# EAGLE design working (EAGLE 9.6.2)
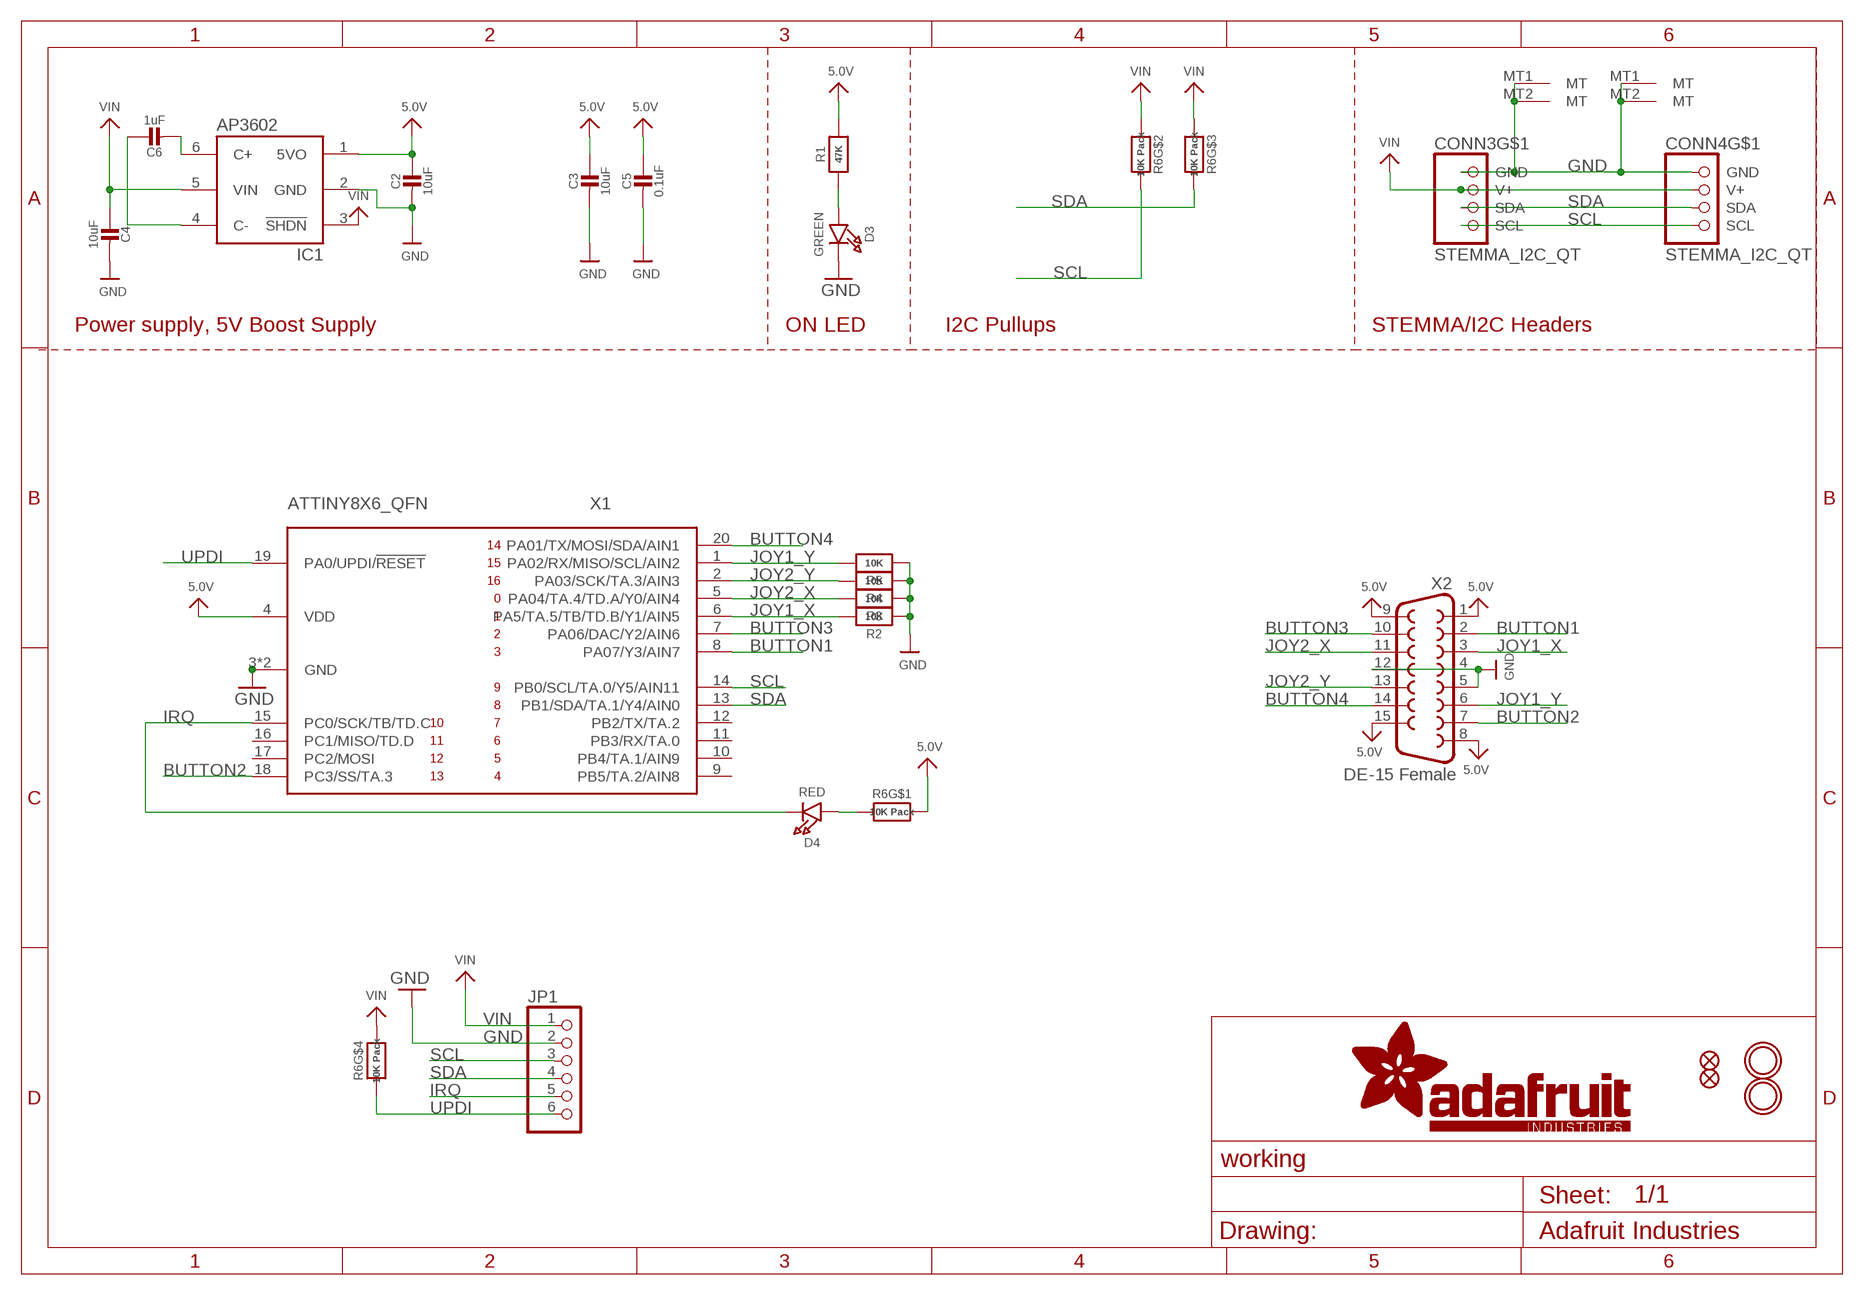
[diagram p0: schematic, sheet 1]

## Parts
C2  10uF  CAP_CERAMIC0805-NOOUTLINE  [0805-NO]
C3  10uF  CAP_CERAMIC0805-NOOUTLINE  [0805-NO]
C4  10uF  CAP_CERAMIC0805-NOOUTLINE  [0805-NO]
C5  0.1uF  CAP_CERAMIC0603_NO  [0603-NO]
C6  1uF  CAP_CERAMIC0603_NO  [0603-NO]
CONN3  STEMMA_I2C_QT  [JST_SH4]
CONN4  STEMMA_I2C_QT  [JST_SH4]
D3  GREEN  LED0603_NOOUTLINE  [CHIPLED_0603_NOOUTLINE]
D4  RED  LED0603_NOOUTLINE  [CHIPLED_0603_NOOUTLINE]
FID1  FIDUCIAL_1MM  [FIDUCIAL_1MM]
FID2  FIDUCIAL_1MM  [FIDUCIAL_1MM]
IC1  AP3602  [SOT23-6]
JP1  HEADER-1X670MIL  [1X06_ROUND_70]
R1  47K  RESISTOR_0603_NOOUT  [0603-NO]
R2  10K  RESISTOR_0603_NOOUT  [0603-NO]
R3  10K  RESISTOR_0603_NOOUT  [0603-NO]
R4  10K  RESISTOR_0603_NOOUT  [0603-NO]
R5  10K  RESISTOR_0603_NOOUT  [0603-NO]
R6  10K Pack  RESISTOR_4PACK  [RESPACK_4X0603]
U$6  MOUNTINGHOLE2.5  [MOUNTINGHOLE_2.5_PLATED]
U$18  MOUNTINGHOLE2.5  [MOUNTINGHOLE_2.5_PLATED]
X1  ATTINY8X6_QFN  [QFN20_3MM]
X2  DE-15 Female  F15H  [F15H]

## Nets
5.0V: C2.1 C3.1 C5.1 IC1.1(5VO) R1.2 R6.8 X1.4(VDD) X2.1 X2.8 X2.9 X2.15
BUTTON1: X1.8(PA07/Y3/AIN7) X2.2
BUTTON2: X1.18(PC3/SS/TA.3) X2.7
BUTTON3: X1.7(PA06/DAC/Y2/AIN6) X2.10
BUTTON4: X1.20(PA01/TX/MOSI/SDA/AIN1) X2.14
GND [highpower]: C2.2 C3.2 C4.2 C5.2 CONN3.1(GND) CONN3.MT1(MT) CONN3.MT2(MT) CONN4.1(GND) CONN4.MT1(MT) CONN4.MT2(MT) D3.C IC1.2(GND) JP1.2 R2.1 R3.1 R4.1 R5.1 X1.3(GND) X1.PAD(GND) X2.4 X2.5 X2.12
IRQ: D4.C JP1.5 X1.15(PC0/SCK/TB/TD.C)
JOY1_X: R2.2 X1.6(PA5/TA.5/TB/TD.B/Y1/AIN5) X2.3
JOY1_Y: R5.2 X1.1(PA02/RX/MISO/SCL/AIN2) X2.6
JOY2_X: R3.2 X1.5(PA04/TA.4/TD.A/Y0/AIN4) X2.11
JOY2_Y: R4.2 X1.2(PA03/SCK/TA.3/AIN3) X2.13
N$1: D3.A R1.1
N$2: C6.2 IC1.6(C+)
N$3: C6.1 IC1.4(C-)
N$4: D4.A R6.1
SCL: CONN3.4(SCL) CONN4.4(SCL) JP1.3 R6.7 X1.14(PB0/SCL/TA.0/Y5/AIN11)
SDA: CONN3.3(SDA) CONN4.3(SDA) JP1.4 R6.6 X1.13(PB1/SDA/TA.1/Y4/AIN0)
UPDI: JP1.6 R6.4 X1.19(PA0/UPDI/!RESET)
VIN [highpower]: C4.1 CONN3.2(V+) CONN4.2(V+) IC1.3(!SHDN) IC1.5(VIN) JP1.1 R6.2 R6.3 R6.5
Unconnected: X1.9(PB5/TA.2/AIN8) X1.10(PB4/TA.1/AIN9) X1.11(PB3/RX/TA.0) X1.12(PB2/TX/TA.2) X1.16(PC1/MISO/TD.D) X1.17(PC2/MOSI)

## Notes on the sheet
- Power supply, 5V Boost Supply | ON LED | I2C Pullups | STEMMA/I2C Headers

## Library data of the parts
C2-C6 = microbuilder:CAP_CERAMIC: Ceramic Capacitors For new designs, use the packages preceded by an '_' character since they are more reliable: The following footprints should be used on most boards: _0402 - Standard footprint for regular board layouts _0603 - Standard footprint for regular board layouts _0805 - Standard footprint for regular board layouts _1206 - Standard footprint for regular board layouts For extremely tight-pitch boards where space is at a premium, the following 'micro-pitch' footprints can be used (smaller pads, no silkscreen outline, etc.): _0402MP - Micro-pitch footprint for very dense/compact boards _0603MP - Micro-pitch footprint for very dense/compact boards _0805MP - Micro-pitch footprint for very dense/compact boards _1206MP - Micro-pitch footprint for very dense/compact boards
CONN3 CONN4 = adafruit_electromech:STEMMA_I2C; LCSC: C2845363
D3 D4 = microbuilder:LED: LED 0603 - 0603 Surface Mount Package 2mA: Green LED - Low Power (3.9mcd, 2ma, 1.7Vf) - Digikey: 475-2709-2-ND Orange LED - Low Power (9.8mcd, 2ma, 1.8Vf) - Digikey: 475-1194-2-ND Red LED - Low Power (5mcd, 2ma, 1.8Vf) - Digikey: 475-1195-2-ND Yellow LED - Low Power (7mcd, 2ma, 1.8Vf) - Digikey: 475-1196-2-ND 5mA: Blue LED - Low Power (17mcd, 5ma, 2.9Vf) - Digikey: LNJ937W8CRACT-ND 0805 - 0805 Surface Mount Package 2mA: Red LED (8.8mcd, 2mA, 1.8Vf, Clear) - Low Power [Digikey: 475-2510-1-ND] Green LED (5mcd, 2mA, 1.8Vf, Clear) - Low Power [Digikey: 475-2730-1-ND] Yellow LED (11.3mcd, 2mA, 1.8Vf, Clear) - Low Power [Digikey: 475-2555-1-ND] 20mA: Red LED (104mcd, 20mA, Diffused) - LS R976 [Digikey: 475-1278-6-ND] Red LED (12mcd, 20mA, 2.0Vf, Clear) - APT2012EC [Digikey: 754-1128-1-ND] Green LED (15mcd, 20mA, 2.2Vf, Clear) - APT2012GC [Digikey: 754-1131-1-ND] Orange LED (160mcd, 20mA, 2.1Vf, Clear) - APT2012SECK [Digikey: 754-1130-1-ND] 1206 - 1206 Surface Mount Package Green LED (26mcd, 20mA, Diffused) - LG N971 [Digikey: 475-1407-6-ND] Red LED (15mcd, 20mA, Diffused) - LH N974 [Digikey: 475-1416-6-ND] Cree - Cree High-Power Surface Mount LEDs XPEBWT-L1-0000-00D50 - White 111lm 350mA 2.9Vf 6200K 110° XTEAWT-00-0000-00000LEE3 - White 114lm 350mA 2.85Vf 5000K 115° Everlight - Everlight 45-21 Series Surface Mount LEDs 45-21/QK2C-B2832AC2CB2/2T - Warm White 2000mcd 20mA 3.25Vf 3050K 120° 45-21/LK2C-B38452C4CB2/2T - Nuetral White 2000mcd 20mA 3.25Vf 4150K 120° 45-21/LK2C-B50634C6CB2/2T - Cold White 2200mcd 20mA 3.25Vf 5650K 120° PLCC2 Reverse Mount LS T77K-J1L2-1-0-2-R18-Z - Red 11.25mcd 2mA 1.8Vf 630nm 120° LO T77K-L1M2-24-Z - Orange 19.6mcd 2mA 1.8Vf 606nm 120° LY T77K-K2M1-26-Z - Yellow 15.7mcd 2mA 1.8Vf 587nm 120°; ROT: 270
FID1 FID2 = microbuilder:FIDUCIAL: Fiducial Alignment Points Various fiducial points for machine vision alignment.; BOM: EXCLUDE
IC1 = microbuilder:AP3602
JP1 = microbuilder:HEADER-1X6: PIN HEADER
R1-R5 = microbuilder:RESISTOR: Resistors For new designs, use the packages preceded by an '_' character since they are more reliable: The following footprints should be used on most boards: _0402 - Standard footprint for regular board layouts _0603 - Standard footprint for regular board layouts _0805 - Standard footprint for regular board layouts _1206 - Standard footprint for regular board layouts For extremely tight-pitch boards where space is at a premium, the following 'micro-pitch' footprints can be used (smaller pads, no silkscreen outline, etc.): _0402MP - Micro-pitch footprint for very dense/compact boards _0603MP - Micro-pitch footprint for very dense/compact boards _0805MP - Micro-pitch footprint for very dense/compact boards _1206MP - Micro-pitch footprint for very dense/compact boards
R6 = microbuilder:RESISTOR_4PACK: Resistor Packs (4 resistors) 4 x 0603 10K 1/16W - Digikey: YC164J-10KCT-ND
U$6 U$18 = adafruit_electromech:MOUNTINGHOLE: Mounting Hole For #2 screws (0.086"/2.18mm width, 0.094"/2.4mm hole) use 2.5mm; BOM: EXCLUDE
X1 = adafruit_micro:ATTINY8X6
X2 = con-subd:F15: SUB-D; OC_FARNELL: unknown; OC_NEWARK: unknown

## Net classes
1 highpower: width 0.254 mm, drill 0.483 mm

## Board
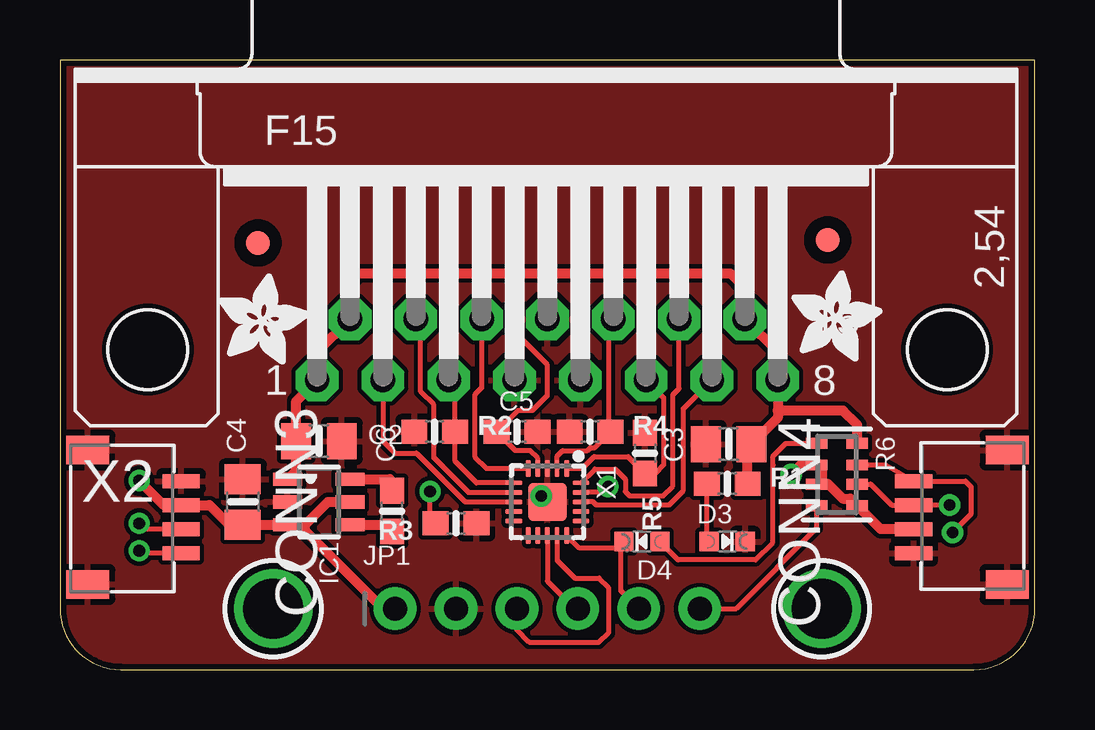
[diagram p1: board, top side]
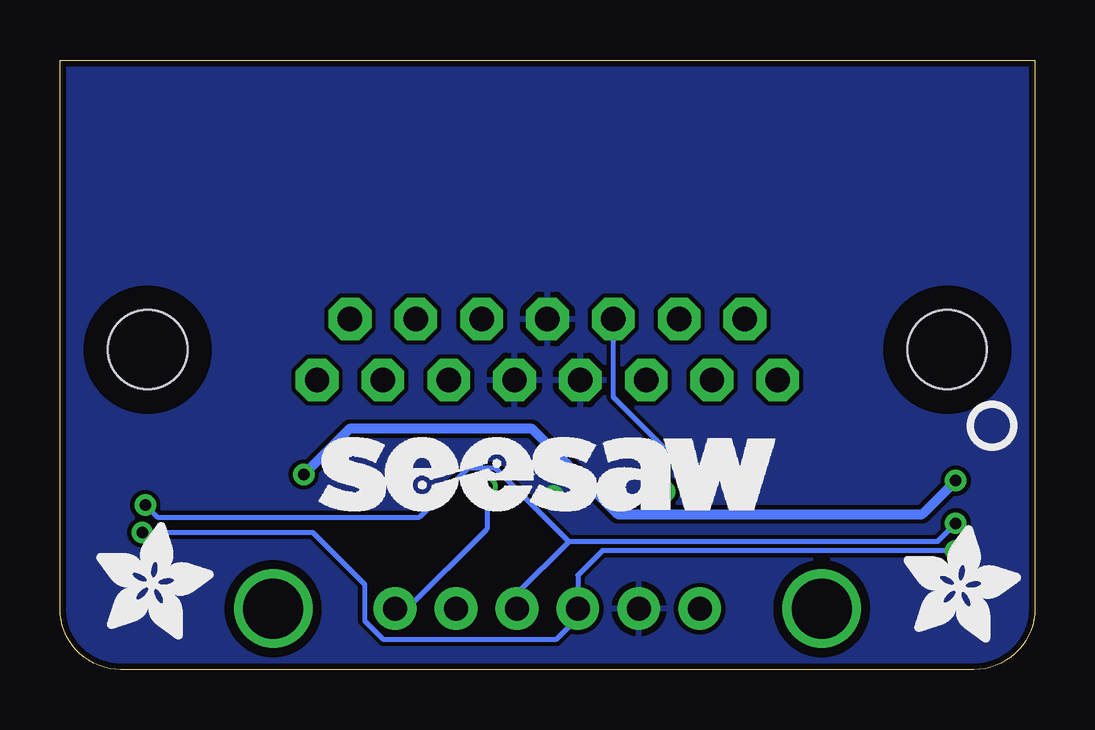
[diagram p2: board, bottom side, seen from below]

Size 40.64 x 25.4 mm. Coordinates in mm from the lower left corner, seen from the top.
Outline: 0,25.4 0,2.54 arc90 2.54,0 38.1,0 arc90 40.64,2.54 40.64,25.4 0,25.4
Copper layers (1*16): Top 0.035mm / dielectric 1.5mm / Bottom 0.035mm
Design rules "adafruit 7-7 *": minimum track width 7mil, minimum drill 15.5mil, track to track 7mil, track to pad 7mil, pad to pad 7mil, via to via 7mil, smd to smd 7mil, copper to edge 10mil, drill to drill 8mil, minimum pad ring 15mil, minimum via ring 8mil, stop-mask expansion 2mil, vias tented up to drill 20mil, thermal gap 10mil

### Footprints (pad centres in the part's own frame; a part is rotated, then mirrored left to right if it is on the bottom)
0805-NO = smd 1.24 x 1.5: 1 -0.95,0; 2 0.95,0
0603-NO = smd 1.075 x 1: 1 -0.85,0; 2 0.85,0
JST_SH4 = smd 0.6 x 1.55: 1 -1.5,2.006; 2 -0.5,2.006; 3 0.5,2.006; 4 1.5,2.006 | smd 1.2 x 1.8: MT1 -2.8,-1.894; MT2 2.8,-1.894
CHIPLED_0603_NOOUTLINE = smd 0.8 x 0.8: A 0,-0.75; C 0,0.75
FIDUCIAL_1MM = smd 1 x 1: 1 0,0
SOT23-6 = smd 0.55 x 1.2: 1 -0.95,-1.3; 2 0,-1.3; 3 0.95,-1.3; 4 0.95,1.3; 5 0,1.3; 6 -0.95,1.3
1X06_ROUND_70 = drill 1 pad 1.778: 1 -6.35,0; 2 -3.81,0; 3 -1.27,0; 4 1.27,0; 5 3.81,0; 6 6.35,0
RESPACK_4X0603 = smd 0.45 x 0.9: 1 -1.3,-0.85; 2 -0.4,-0.85; 3 0.4,-0.85; 4 1.3,-0.85; 5 1.3,0.85; 6 0.4,0.85; 7 -0.4,0.85; 8 -1.3,0.85
MOUNTINGHOLE_2.5_PLATED = drill 2.5 pad 3.2: P$1 0,0
QFN20_3MM = smd 0.7 x 0.2: 1 -1.4,0.8; 2 -1.4,0.4; 3 -1.4,0; 4 -1.4,-0.4; 5 -1.4,-0.8; 11 1.4,-0.8; 12 1.4,-0.4; 13 1.4,0; 14 1.4,0.4; 15 1.4,0.8 | smd 0.2 x 0.7: 6 -0.8,-1.4; 7 -0.4,-1.4; 8 0,-1.4; 9 0.4,-1.4; 10 0.8,-1.4; 16 0.8,1.4; 17 0.4,1.4; 18 0,1.4; 19 -0.4,1.4; 20 -0.8,1.4 | smd 1.6 x 1.6: PAD 0,0
F15H = drill 1.016 octagon: 1 -9.601,-1.27; 2 -6.858,-1.27; 3 -4.115,-1.27; 4 -1.372,-1.27; 5 1.372,-1.27; 6 4.115,-1.27; 7 6.858,-1.27; 8 9.601,-1.27; 9 -8.23,1.27; 10 -5.486,1.27; 11 -2.743,1.27; 12 0,1.27; 13 2.743,1.27; 14 5.486,1.27; 15 8.23,1.27 | hole 3.302: -16.662,0; 16.662,0

### Placement (x,y rotation side)
C2  10.79,9.53 0 top
C3  27.88,9.4 180 top
C4  7.62,6.99 90 top
C5  19.05,9.91 0 top
C6  13.84,6.6 90 top
CONN3  3.05,6.35 270 top
CONN4  37.59,6.35 90 top
D3  27.81,5.33 270 top
D4  24.26,5.33 90 top
FID1  32,17.91 90 top
FID2  8.26,17.78 90 top
IC1  10.79,6.99 270 top
JP1  20.32,2.54 0 top
PLABEL0  [PLABEL0]  13.97,4.19 0 top
PLABEL1  [PLABEL1]  16.64,0.89 0 top
PLABEL2  [PLABEL2]  19.05,4.19 0 top
PLABEL3  [PLABEL3]  21.59,0.89 0 top
PLABEL4  [PLABEL4]  24.26,4.19 0 top
PLABEL5  [PLABEL5]  26.8,0.89 0 top
PLABEL6  [PLABEL6]  27.81,6.48 0 top
PLABEL7  [PLABEL7]  33.78,2.03 0 top
PLABEL8  [PLABEL8]  40.77,18.29 0 bottom
PLABEL9  [PLABEL9]  9.14,18.16 0 bottom
PLABEL10  [PLABEL10]  20.7,21.21 0 bottom
PLABEL11  [PLABEL11]  20.45,5.21 0 bottom
R1  27.81,7.75 0 top
R2  15.62,9.91 0 top
R3  16.51,6.1 180 top
R4  22.1,9.91 0 top
R5  24.38,9.02 270 top
R6  32.38,8.13 270 top
U$6  8.89,2.54 0 top
U$7  [SEESAW_LOGO]  29.84,6.6 0 bottom
U$12  [PCBFEAT-REV-040]  1.78,10.16 180 bottom
U$18  31.75,2.54 0 top
U$20  [ADAFRUIT_5MM]  5.46,1.14 0 bottom
U$30  [ADAFRUIT_3.5MM]  6.6,12.7 0 top
U$31  [ADAFRUIT_3.5MM]  30.48,12.83 0 top
U$32  [ADAFRUIT_5MM]  39.12,1.27 0 bottom
X1  20.32,6.99 270 top
X2  20.32,13.34 0 top

### Tracks (layer width: path | path; a pad name or v marks a point on that pad's centre or on a via)
5.0V
  Top 0.203: X1.4 19.92,8.8 19.59,9.13 18.98,9.13 C5.1 19.09,10.79 19.68,10.79 20.32,11.43 20.32,12.7 18.92,14.1
  Top 0.406: IC1.1 9.85,8.29 C2.1 9.85,11.19 X2.1 10.72,13.23 X2.9 12.09,16.15 12.45,16.51 18.8,16.51 | 29.92,10.79 X2.8 29.92,13.23 X2.15 28.57,14.63 28.57,15.88 27.94,16.51 18.8,16.51 | 29.92,10.79 29.92,10.49 C3.1 28.66,9.23 R1.2 | R6.8 33.23,10.2 32.64,10.79 29.92,10.79 | 18.8,16.51 18.92,16.38 18.92,14.1
BUTTON1
  Top 0.203: X1.8 16.89,6.99 14.86,9.02 13.97,9.02 13.46,9.53 X2.2
BUTTON2
  Top 0.203: X1.18 22.23,6.99 22.36,6.86 25.38,6.86 25.98,7.46 25.98,10.87 X2.7
BUTTON3
  Top 0.203: X1.7 17.03,7.38 15.59,8.83 15.59,11.03 15.04,11.58 15.04,14.4 X2.10
BUTTON4
  Top 0.203: X2.14 25.81,11.71 25.54,11.45 25.54,7.64 25.14,7.24 23.75,7.24 23.57,7.42 23.57,7.93 23.15,8.36 22.29,8.36 X1.20
GND  (via drill 0.48)
  Top 0.254: X1.PAD v20.07,7.24
  pour Top: 0,25.4 40.64,25.4 40.64,0 0,0
  pour Bottom: 0,25.4 40.64,25.4 40.64,0 0,0
IRQ
  Top 0.203: JP1.5 23.38,3.29 23.38,5.08 | D4.C 23.51,5.08 23.38,5.08 | X1.15 21.62,5.08 23.38,5.08
JOY1_X
  Top 0.203: X1.6 17.36,7.79 16.47,8.68 R2.2 16.47,11.8 X2.3
JOY1_Y
  Top 0.203: X1.1 21.78,8.38 22.27,8.87 23.68,8.87 R5.2 24.8,8.17 25.16,8.53 25.16,11.34 X2.6
JOY2_X  (via drill 0.48)
  Top 0.203: X2.11 17.58,11.73 17.29,11.45 17.29,8.87 17.78,8.38 X1.5 | R3.2 15.43,6.33 v15.43,7.43
  Bottom 0.203: v15.43,7.43 15.43,9.2 17.58,11.35 X2.11
JOY2_Y
  Top 0.203: X1.2 20.72,8.89 20.95,9.13 21.98,9.13 22.11,9.25 22.3,9.25 R4.2 22.86,9.99 22.86,14.4 X2.13
N$1
  Top 0.203: D3.A 26.96,5.43 R1.1
N$2
  Top 0.406: C6.2 13.74,7.93 IC1.6
N$3
  Top 0.406: IC1.4 13.69,6.04 C6.1
N$4
  Top 0.203: R6.1 30.26,9.43 29.73,8.9 29.73,8.53 29.72,8.52 29.72,5.29 29,4.57 25.77,4.57 D4.A
SCL  (via drill 0.48)
  Top 0.203: R6.7 34.4,8.53 CONN4.4 37.74,7.85 37.97,7.62 37.97,6.48 v37.21,5.71 | X1.14 20.72,4.55 21.46,3.81 22.48,3.81 22.86,3.43 22.86,1.52 22.48,1.14 19.56,1.14 19.05,1.65 JP1.3 | CONN3.4 3.4,4.85 v3.3,4.95
  Bottom 0.203: v3.3,4.95 18.03,4.95 19.05,3.94 JP1.3 19.05,2.16 19.94,1.27 27.18,1.27 27.94,2.03 27.94,3.56 30.1,5.71 v37.21,5.71
SDA  (via drill 0.48)
  Top 0.203: R6.6 33.8,7.73 34.68,6.85 CONN4.3 v37.08,6.85 v37.08,6.86 | X1.13 20.32,3.68 21.46,2.54 JP1.4 | CONN3.3 3.55,5.85 v3.3,6.1
  Bottom 0.203: v3.3,6.1 4.06,5.33 19.43,5.33 | JP1.4 21.59,3.17 19.43,5.33 | 19.43,5.33 22.48,8.38 23.62,8.38 25.65,6.35 36.58,6.35 v37.08,6.86
UPDI  (via drill 0.48)
  Top 0.203: R6.4 31.54,5.88 28.19,2.54 JP1.6 | X1.19 21.74,7.4 22.79,7.4 22.85,7.46 v22.85,7.63
  Bottom 0.203: v22.85,7.63 22.85,5.86 26.16,2.54 JP1.6
VIN  (via drill 0.48)
  Top 0.406: 10.23,6.04 IC1.3 C4.1 7.05,6.04 6.23,6.85 CONN3.2 4.33,6.85 v3.3,7.87 | 10.23,6.04 11.18,6.99 IC1.5 | JP1.1 13.46,2.54 10.23,5.78 10.23,6.04 | CONN4.2 34.21,5.85 R6.5 32.94,7.12 32.63,7.12 32.02,7.73 31.75,7.73 | R6.3 31.75,7.73 | 31.75,7.73 31.75,8.31 R6.2 30.88,8.53 v30.48,8.13
  Bottom 0.406: v3.3,7.87 4.7,6.48 17.4,6.48 20.95,10.03 28.57,10.03 v30.48,8.13

### Text on the board
Pinguin_tBackup: 5V | VIN | SCL | IRQ | PC / Joystick | GND | SDA | UPDI
Pinguin_bBackup: DE-15 PC Joystick / to I2C Stemma QT | 🕹️ | 🕹️ | Vin/Vlogic: 3.3-5V